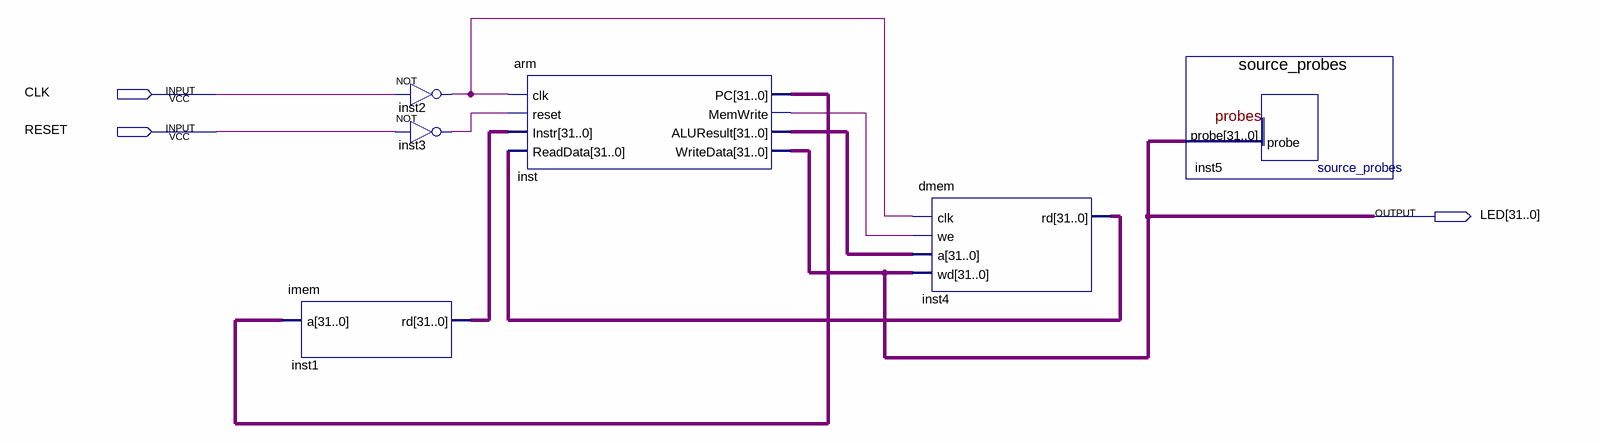
[diagram p0: schematic sheet]
// Quartus schematic ArmSingle.bdf as structural Verilog: 6 symbols, 3 pins
module ArmSingle (
  input  CLK,
  input  RESET,
  output [31:0] LED
);

  wire inst2_out, inst3_out, inst_memwrite;
  wire [31:0] inst1_rd, inst4_rd, inst_aluresult, inst_pc;

  imem inst1 (.a(inst_pc), .rd(inst1_rd));
  not inst2 (inst2_out, CLK);
  not inst3 (inst3_out, RESET);
  arm inst (
    .clk(inst2_out), .reset(inst3_out), .Instr(inst1_rd), .ReadData(inst4_rd), .PC(inst_pc),
    .MemWrite(inst_memwrite), .ALUResult(inst_aluresult), .WriteData(LED));
  dmem inst4 (.clk(inst2_out), .we(inst_memwrite), .a(inst_aluresult), .wd(LED), .rd(inst4_rd));
  source_probes inst5 (.probe(LED));
endmodule
